# EAGLE design picoBuck (EAGLE 9.5.2)
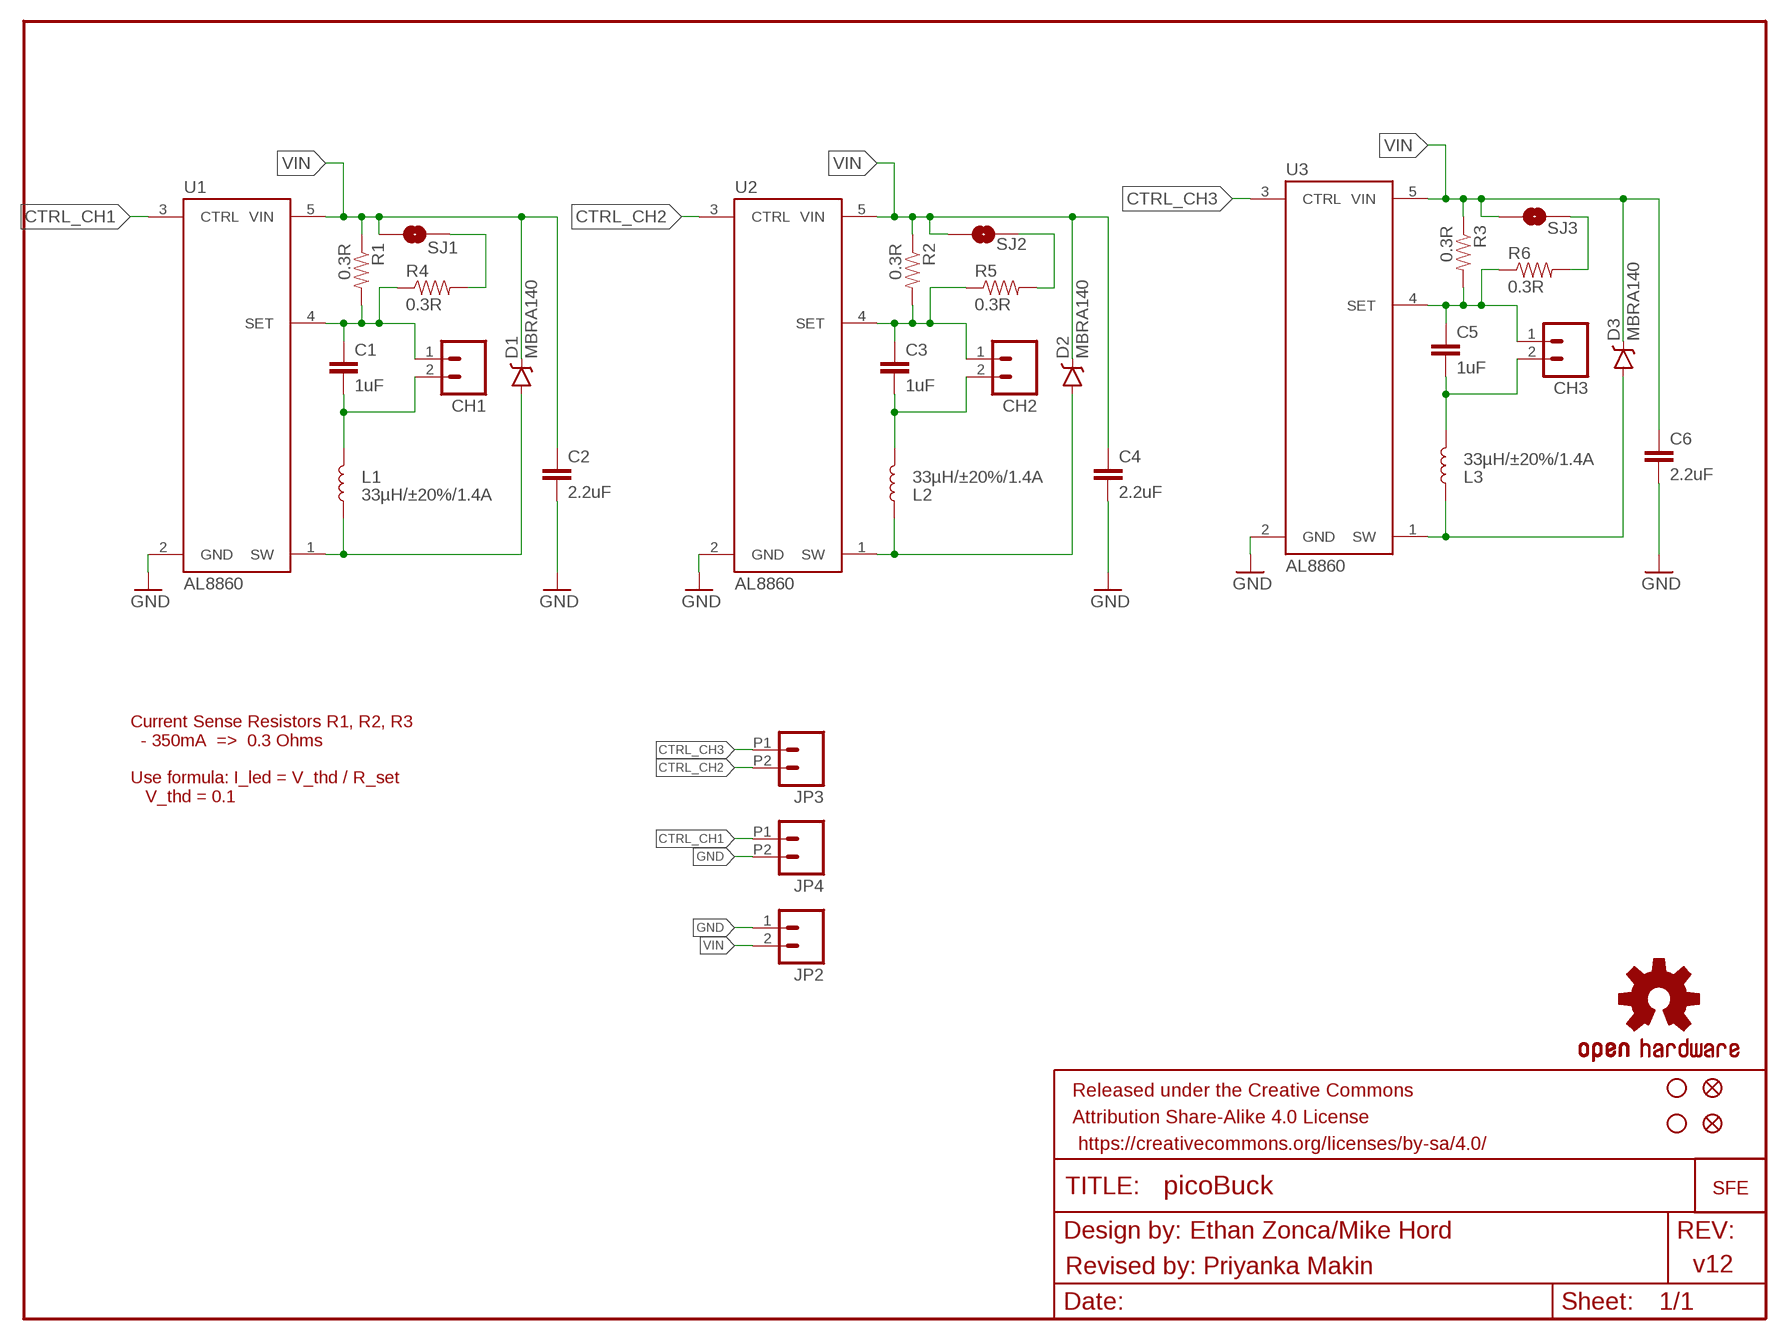
[diagram p0: schematic, sheet 1]

## Parts
C1  1uF  1.0UF-25V-+80/-20(0805)  [0805]
C2  2.2uF  2.2UF-25V-+80/-20(0805)  [0805]
C3  1uF  1.0UF-25V-+80/-20(0805)  [0805]
C4  2.2uF  2.2UF-25V-+80/-20(0805)  [0805]
C5  1uF  1.0UF-25V-+80/-20(0805)  [0805]
C6  2.2uF  2.2UF-25V-+80/-20(0805)  [0805]
CH1  CONN_023.5MM_LOCK  [SCREWTERMINAL-3.5MM-2_LOCK]
CH2  CONN_023.5MM_LOCK  [SCREWTERMINAL-3.5MM-2_LOCK]
CH3  CONN_023.5MM_LOCK  [SCREWTERMINAL-3.5MM-2_LOCK]
D1  MBRA140  DIODE-SCHOTTKY-MBRA140  [SMA-DIODE]
D2  MBRA140  DIODE-SCHOTTKY-MBRA140  [SMA-DIODE]
D3  MBRA140  DIODE-SCHOTTKY-MBRA140  [SMA-DIODE]
FID1  FIDUCIALUFIDUCIAL  [MICRO-FIDUCIAL]
FID2  FIDUCIALUFIDUCIAL  [MICRO-FIDUCIAL]
FRAME1  FRAME-LETTER  [CREATIVE_COMMONS]
JP2  CONN_023.5MM_LOCK  [SCREWTERMINAL-3.5MM-2_LOCK]
JP3  M022.54MM_SCREWTERM  [1X02_2.54_SCREWTERM@1]
JP4  M022.54MM_SCREWTERM  [1X02_2.54_SCREWTERM@1]
L1  33µH/±20%/1.4A  INDUCTOR-SRN6045-33UH  [SRN6045]
L2  33µH/±20%/1.4A  INDUCTOR-SRN6045-33UH  [SRN6045]
L3  33µH/±20%/1.4A  INDUCTOR-SRN6045-33UH  [SRN6045]
LOGO1  OSHW-LOGOS  [OSHW-LOGO-S]
LOGO2  LOGO-SFENEW  [SFE-NEW-WEBLOGO]
R1  0.3R  0.3OHM-1/8W-1%(0805)  [0805]
R2  0.3R  0.3OHM-1/8W-1%(0805)  [0805]
R3  0.3R  0.3OHM-1/8W-1%(0805)  [0805]
R4  0.3R  0.3OHM-1/8W-1%(0805)  [0805]
R5  0.3R  0.3OHM-1/8W-1%(0805)  [0805]
R6  0.3R  0.3OHM-1/8W-1%(0805)  [0805]
SJ1  JUMPER-SMT_2_NO_NO-SILK  [SMT-JUMPER_2_NO_NO-SILK]
SJ2  JUMPER-SMT_2_NO_NO-SILK  [SMT-JUMPER_2_NO_NO-SILK]
SJ3  JUMPER-SMT_2_NO_NO-SILK  [SMT-JUMPER_2_NO_NO-SILK]
STANDOFF1  STAND-OFF  [STAND-OFF]
STANDOFF2  STAND-OFF  [STAND-OFF]
U1  AL8860  AL8860SOT23  [SOT23-5]
U2  AL8860  AL8860SOT23  [SOT23-5]
U3  AL8860  AL8860SOT23  [SOT23-5]

## Nets
CTRL_CH1: JP4.P1 U1.3(CTRL)
CTRL_CH2: JP3.P2 U2.3(CTRL)
CTRL_CH3: JP3.P1 U3.3(CTRL)
GND: C2.2 C4.2 C6.2 JP2.1 JP4.P2 U1.2(GND) U2.2(GND) U3.2(GND)
IND1-1: D1.A L1.1 U1.1(SW)
IND2-1: D2.A L2.1 U2.1(SW)
IND3-1: D3.A L3.1 U3.1(SW)
N$1: C5.1 CH3.1 R3.2 R6.1 U3.4(SET)
N$2: R4.2 SJ1.2
N$3: R5.2 SJ2.2
N$5 [power]: C1.2 CH1.2 L1.2
N$7: R6.2 SJ3.2
N$9 [power]: C3.2 CH2.2 L2.2
N$11: C1.1 CH1.1 R1.2 R4.1 U1.4(SET)
N$13: C3.1 CH2.1 R2.2 R5.1 U2.4(SET)
N$16 [power]: C5.2 CH3.2 L3.2
VIN: C2.1 C4.1 C6.1 D1.C D2.C D3.C JP2.2 R1.1 R2.1 R3.1 SJ1.1 SJ2.1 SJ3.1 U1.5(VIN) U2.5(VIN) U3.5(VIN)

## Notes on the sheet
- Current Sense Resistors R1, R2, R3
    - 350mA  =>  0.3 Ohms
  
  Use formula: I_led = V_thd / R_set
     V_thd = 0.1
- Ethan Zonca/Mike Hord
- Revised by: Priyanka Makin | v12

## Library data of the parts
C1 C3 C5 = SparkFun-Capacitors:1.0UF-25V-+80/-20(0805); PROD_ID: CAP-11625; VALUE: 1.0uF
C2 C4 C6 = SparkFun-Capacitors:2.2UF-25V-+80/-20(0805); PROD_ID: CAP-11624
CH1-CH3 JP2 = SparkFun-Connectors:CONN_02: Multi connection point. Often used as Generic Header-pin footprint for 0.1 inch spaced/style header connections On any of the 0.1 inch spaced packages, you can populate with these: Break Away Headers - Straight <https://www.sparkfun.com/products/116> (PRT-00116) Break Away Male Headers - Right Angle <https://www.sparkfun.com/products/553> (PRT-00553) Female Headers <https://www.sparkfun.com/products/115> (PRT-00115) Break Away Headers - Machine Pin <https://www.sparkfun.com/products/117> (PRT-00117) Break Away Female Headers - Swiss Machine Pin <https://www.sparkfun.com/products/743> (PRT-00743) For SCREWTERMINALS and SPRING TERMINALS visit here: Screw Terimnals on SparkFun.com <https://www.sparkfun.com/search/results?term=Screw+Terminals> (5mm/3.5mm/2.54mm spacing) This device is also useful as a general connection point to wire up your design to another part of your project. Our various solder wires solder well into these plated through hole pads. Hook-Up Wire - Assortment (Stranded, 22 AWG) <https://www.sparkfun.com/products/11375> (PRT-11375) Hook-Up Wire - Assortment (Solid Core, 22 AWG) <https://www.sparkfun.com/products/11367> (PRT-11367) View the entire wire category on our website here <https://www.sparkfun.com/categories/141> Special notes: Molex polarized connector foot print use with: PRT-08233 with associated crimp pins and housings. 2.54_SCREWTERM for use with PRT-10571. 3.5mm Screw Terminal footprints for PRT-08084 5mm Screw Terminal footprints for use with PRT-08432; PROD_ID: CONN-08399
D1-D3 = SparkFun-DiscreteSemi:DIODE-SCHOTTKY: Schottky diodes in SFE's production catalog BAT20J 1A 23V 0.62Vf RB751 120mA 40V 0.37Vf PMEG4005EJ 0.5A 40V 0.42Vf MBRA140 1A 40V 0.5Vf B340A 3A 40V SMA; PROD_ID: DIO-08053
FID1 FID2 = SparkFun-Aesthetics:FIDUCIAL: Fiducial Alignment Points Various fiducial points for machine vision alignment.
FRAME1 = SparkFun-Aesthetics:FRAME-LETTER: Schematic Frame Standard 8.5x11 US Letter frame
JP3 JP4 = SparkFun-Connectors:M02: Standard 2-pin 0.1" header. Use with - straight break away headers ( PRT-00116) - right angle break away headers (PRT-00553) - swiss pins (PRT-00743) - machine pins (PRT-00117) - female headers (PRT-00115) Molex polarized connector foot print use with: PRT-08233 with associated crimp pins and housings. 2.54_SCREWTERM for use with PRT-10571. 3.5mm Screw Terminal footprints for PRT-08084 5mm Screw Terminal footprints for use with PRT-08433
L1-L3 = SparkFun-Coils:INDUCTOR: Inductors Resist changes in electrical current. Basically a coil of wire. SparkFun Products: SparkFun Load Cell Amplifier - HX711 <https://www.sparkfun.com/products/13879> IOIO-OTG - V2.2 <https://www.sparkfun.com/products/13613>; PROD_ID: NDUC-11627
LOGO1 = SparkFun-Aesthetics:OSHW-LOGO: Open Source Hardware Logo This logo indicates the piece of hardware it is found on incorporates a OSHW license and/or adheres to the definition of open source hardware found here: http://freedomdefined.org/OSHW
LOGO2 = SparkFun-Aesthetics:LOGO-SFE: Spark Fun Electronics PCB Logo This is the standard Spark Fun Electronics PCB logo.
R1-R6 = SparkFun-Resistors:0.3OHM-1/8W-1%(0805); PROD_ID: RES-11622; VALUE: 0.3
SJ1-SJ3 = SparkFun-Jumpers:JUMPER-SMT_2_NO: Normally open jumper This jumper has two pads in close proximity to each other. Apply solder to close the connection. Round pads are easier to solder for beginners, but are a lot larger. SparkFun Product that uses the round pads: SparkFun EL Sequencer <https://www.sparkfun.com/products/12781>
STANDOFF1 STANDOFF2 = SparkFun-Electromechanical:STAND-OFF: #4 Stand Off This is the mechanical footprint for a #4 phillips button head screw. Use the keepout ring to avoid running the screw head into surrounding components. SKU : PRT-00447
U1-U3 = SparkFun-IC-Special-Function:AL8860: The AL8860 is a buck LED driver that's used on the PicoBuck and FemtoBuck products. It's a replacement for the AL8805 which has gone EOL.; PROD_ID: IC-16593

## Net classes
0 default: width 0.254 mm
1 power: width 0.508 mm

## Board
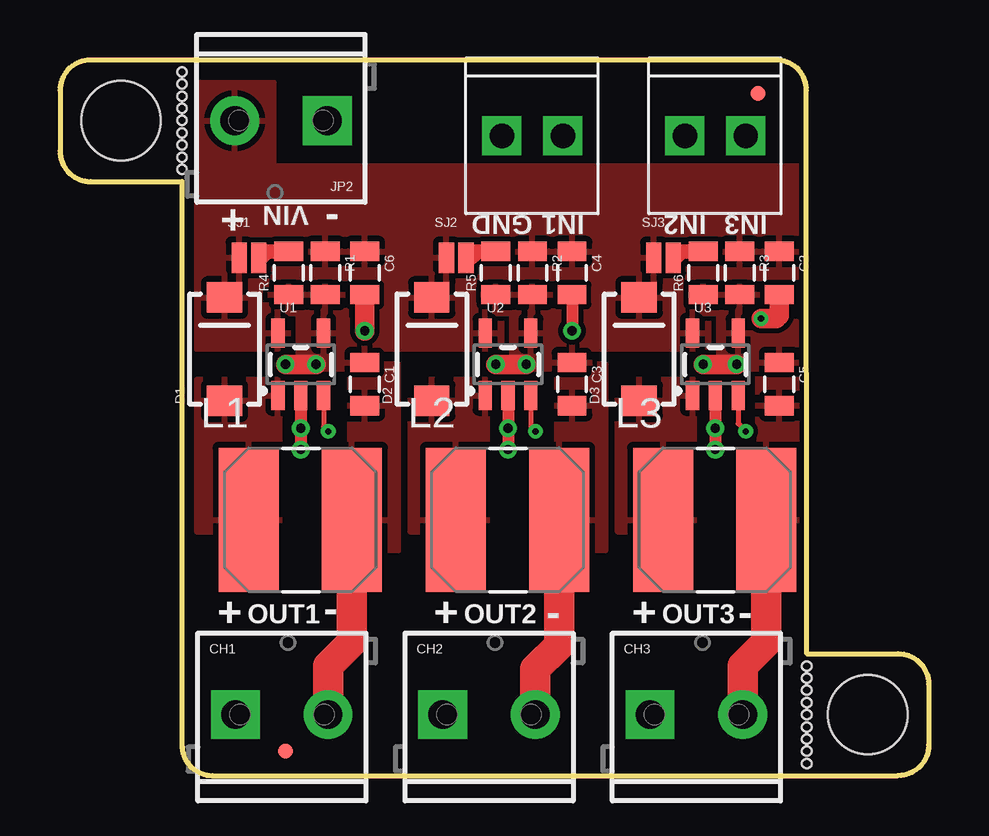
[diagram p1: board, top side]
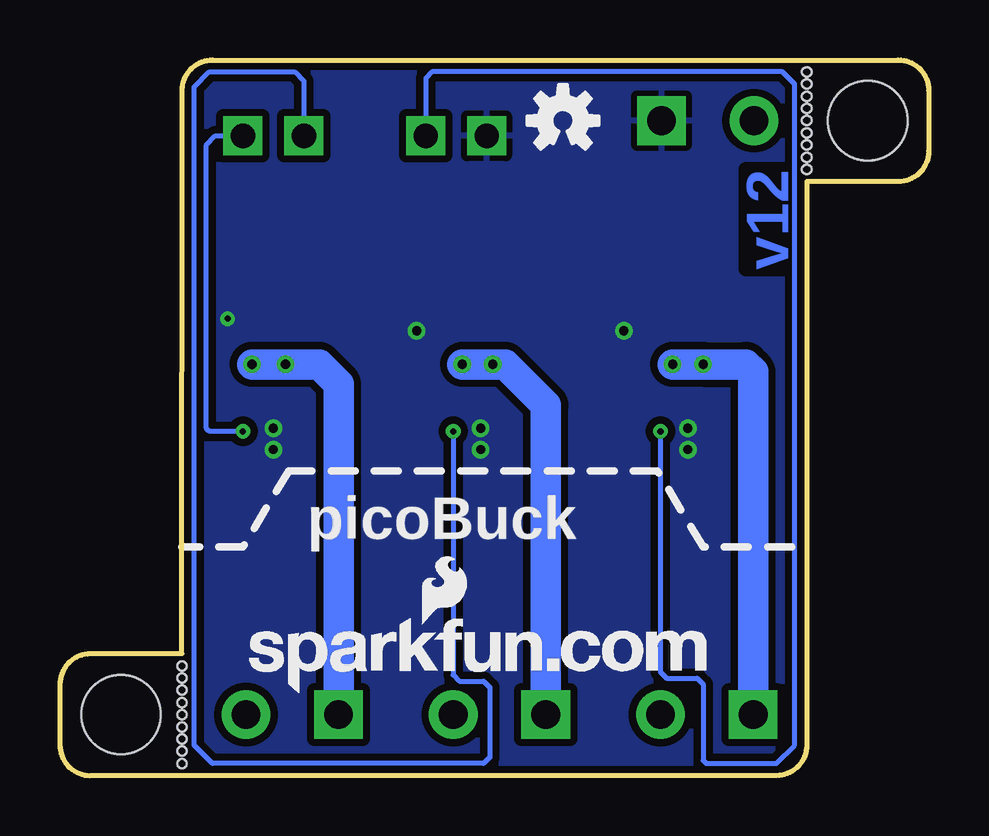
[diagram p2: board, bottom side, seen from below]

Size 36.2 x 29.84 mm. Coordinates in mm from the lower left corner, seen from the top.
Outline: 34.91,0 6.35,0 arc-90 5.08,1.27 5.08,24.77 1.27,24.77 arc-90 0,26.04 0,28.57 arc-90 1.27,29.84 29.83,29.84 arc-90 31.1,28.57 31.12,5.08 34.92,5.08 arc-90 36.2,3.81 36.2,1.27 arc-90 34.92,0
Copper layers (1*16): Top 0.035mm / dielectric 1.5mm / Bottom 0.035mm
Design rules "SparkFun-2-layer": minimum track width 7mil, minimum drill 15mil, track to track 8mil, track to pad 8mil, pad to pad 8mil, via to via 8mil, smd to smd 8mil, copper to edge 8mil, drill to drill 8mil, minimum pad ring 12mil, minimum via ring 7mil, stop-mask expansion 4mil, vias tented up to drill 20mil, thermal gap 10mil
Holes 0.38 mm at 31.12,4.57 31.12,4.06 31.12,3.56 31.12,3.05 31.12,2.54 31.12,2.03 31.12,1.52 31.12,1.02 31.12,0.51 5.08,29.34 5.08,28.83 5.08,28.32 5.08,27.81 5.08,27.3 5.08,26.8 5.08,26.29 5.08,25.78 5.08,25.27

### Footprints (pad centres in the part's own frame; a part is rotated, then mirrored left to right if it is on the bottom)
0805 = smd 0.8 x 1.2: 1 -0.9,0; 2 0.9,0
SCREWTERMINAL-3.5MM-2_LOCK = drill 1.2 pad 2.032 square: 1 -0.178,0 | drill 1.2 pad 2.032: 2 3.678,0
SMA-DIODE = smd 1.27 x 1.47: A -2.15,0; C 2.15,0
MICRO-FIDUCIAL = smd 0.635 x 0.635: 1 0,0
1X02_2.54_SCREWTERM@1 = drill 1.016 square: P1 2.54,0; P2 0,0
SRN6045 = smd 2.5 x 6: 1 -2.175,0; 2 2.125,0
SMT-JUMPER_2_NO_NO-SILK = smd 0.635 x 1.27: 1 -0.406,0; 2 0.406,0
STAND-OFF = hole 3.302: 0,0
SOT23-5 = smd 0.55 x 1.2: 1 -0.95,-1.3; 2 0,-1.3; 3 0.95,-1.3; 4 0.95,1.3; 5 -0.95,1.3

### Placement (x,y rotation side)
C1  12.7,16.32 270 top
C2  29.97,20.95 270 top
C3  21.34,16.32 270 top
C4  21.34,20.95 270 top
C5  29.97,16.32 270 top
C6  12.7,20.95 270 top
CH1  7.49,2.54 0 top
CH2  16.13,2.54 0 top
CH3  24.77,2.54 0 top
D1  6.86,17.78 90 top
D2  15.49,17.78 90 top
D3  24.13,17.78 90 top
FID1  9.4,1.02 0 top
FID2  29.08,28.45 0 top
FRAME1  16.51,-31.75 0 top  (outside the outline)
JP2  10.95,27.3 180 top
JP3  26.03,26.67 0 top
JP4  18.41,26.67 0 top
L1  10.03,10.67 0 top
L2  18.67,10.67 0 top
L3  27.3,10.67 0 top
LOGO1  15.24,27.3 0 bottom
LOGO2  28.32,3.43 0 bottom
R1  11.05,20.95 270 top
R2  19.69,20.95 270 top
R3  28.32,20.95 270 top
R4  9.53,20.95 90 top
R5  18.16,20.95 90 top
R6  26.8,20.95 90 top
SJ1  7.87,21.59 0 top
SJ2  16.51,21.59 0 top
SJ3  25.15,21.59 0 top
STANDOFF1  2.54,27.3 0 top
STANDOFF2  33.66,2.54 0 top
U1  10.03,17.14 0 top
U2  18.67,17.14 0 top
U3  27.3,17.14 0 top

### Tracks (layer width: path | path; a pad name or v marks a point on that pad's centre or on a via)
CTRL_CH1  (via drill 0.25)
  Top 0.203: U1.3 10.98,14.54 v11.18,14.35
  Bottom 0.203: v11.18,14.35 11.18,4.32 10.92,4.06 9.65,4.06 9.4,3.81 9.4,0.64 9.27,0.51 6.35,0.51 5.59,1.27 5.59,28.83 6.1,29.34 20.7,29.34 20.95,29.08 JP4.P1
CTRL_CH2  (via drill 0.25)
  Top 0.203: U2.3 19.62,14.54 v19.81,14.35
  Bottom 0.203: v19.81,14.35 19.81,4.19 19.56,3.94 18.54,3.94 18.29,3.68 18.29,0.76 18.54,0.51 29.84,0.51 30.61,1.27 30.61,28.7 29.97,29.34 26.42,29.34 26.03,28.96 JP3.P2
CTRL_CH3  (via drill 0.25)
  Top 0.203: U3.3 28.26,14.67 v28.58,14.35
  Bottom 0.203: v28.58,14.35 29.97,14.35 30.1,14.48 30.1,26.29 29.72,26.67 JP3.P1
GND  (via drill 0.25, 0.38)
  Top 0.508: U1.2 v10.03,14.48 v10.03,13.59 | U2.2 v18.67,14.48 v18.67,13.59 | U3.2 v27.3,14.48 v27.3,13.59 | C4.2 v21.34,18.54
  Top 0.813: C6.2 v12.7,18.54 | C2.2 29.97,19.18 29.84,19.05 v29.21,19.05
  pour Bottom (isolate 0.305): 5.11,29.82 31.12,29.84 31.12,0 5.08,0
IND1-1
  pour Top (isolate 0.203, rank 3): 5.71,16.51 9.14,16.51 9.14,10.16 5.71,10.16
IND2-1
  pour Top (isolate 0.203): 14.61,16.51 17.78,16.51 17.78,10.16 14.61,10.16
IND3-1
  pour Top (isolate 0.203): 23.24,16.51 26.42,16.51 26.42,10.16 23.24,10.16
N$1  (via drill 0.38)
  Top 0.813: v26.8,17.14 v28.19,17.14
  Bottom 1.27: CH3.1 24.59,16.33 25.4,17.14 v26.8,17.14 v28.19,17.14
  pour Top (isolate 0.203): 27.43,16.95 30.73,16.95 30.73,18.92 29.59,18.92 29.46,19.05 29.46,20.38 26.26,20.38 26.26,19.27 27.43,19.27
N$2
  Top 0.61: 8.64,21.84 8.38,21.59 SJ1.2 8.59,21.86 R4.2
N$3
  Top 0.61: 17.27,21.72 17.14,21.59 SJ2.2 17.23,21.86 R5.2
N$5
  Top 1.27: CH1.2 11.17,4.57 12.16,5.55 L1.2
  pour Top (isolate 0.203, rank 3): 12.07,17.14 12.07,9.4 14.1,9.4 14.1,17.14
N$7
  Top 0.61: 25.91,21.84 25.65,21.59 SJ3.2 25.86,21.86 R6.2
N$9
  Top 1.27: L2.2 20.79,5.43 19.81,4.44 CH2.2
  pour Top (isolate 0.203, rank 3): 20.7,17.14 20.7,9.4 22.73,9.4 22.73,17.14
N$11  (via drill 0.38)
  Top 0.813: v10.67,17.14 v9.4,17.14
  Bottom 1.27: CH1.1 7.31,16.84 7.62,17.14 v9.4,17.14 v10.67,17.14
  pour Top (isolate 0.203): 9.91,16.95 13.21,16.95 13.21,18.92 12.07,18.92 11.94,19.05 11.94,20.38 8.73,20.38 8.73,19.27 9.91,19.27
N$13  (via drill 0.38)
  Top 0.813: v18.16,17.14 v19.43,17.14
  Bottom 1.27: CH2.1 15.95,15.44 17.65,17.14 v18.16,17.14 v19.43,17.14
  pour Top (isolate 0.203): 18.8,16.95 22.1,16.95 22.1,18.92 20.95,18.92 20.83,19.05 20.83,20.38 17.62,20.38 17.62,19.27 18.8,19.27
N$16
  Top 1.27: CH3.2 28.44,4.57 29.43,5.55 L3.2
  pour Top (isolate 0.203, rank 3): 29.08,17.14 29.08,9.4 31.12,9.4 31.12,17.14
VIN
  pour Top (isolate 0.203, rank 2): 5.71,28.89 8.89,28.89 8.89,25.4 31.12,25.4 31.12,17.78 5.71,17.78

### Text on the board
Bottom: v12
tPlace: + | VIN | - | GND | IN1 | IN2 | IN3 | + | OUT1 | - | + | OUT2 | - | + | OUT3 | -
bPlace: picoBuck
Measures: #4-40 typ. | (typ.) | (typ.) | Units are inches
tDocu: Ethan Zonca/Mike Hord